# Altium schematic sheet Nixie_Sch.SchDoc
size 381 x 241 mm
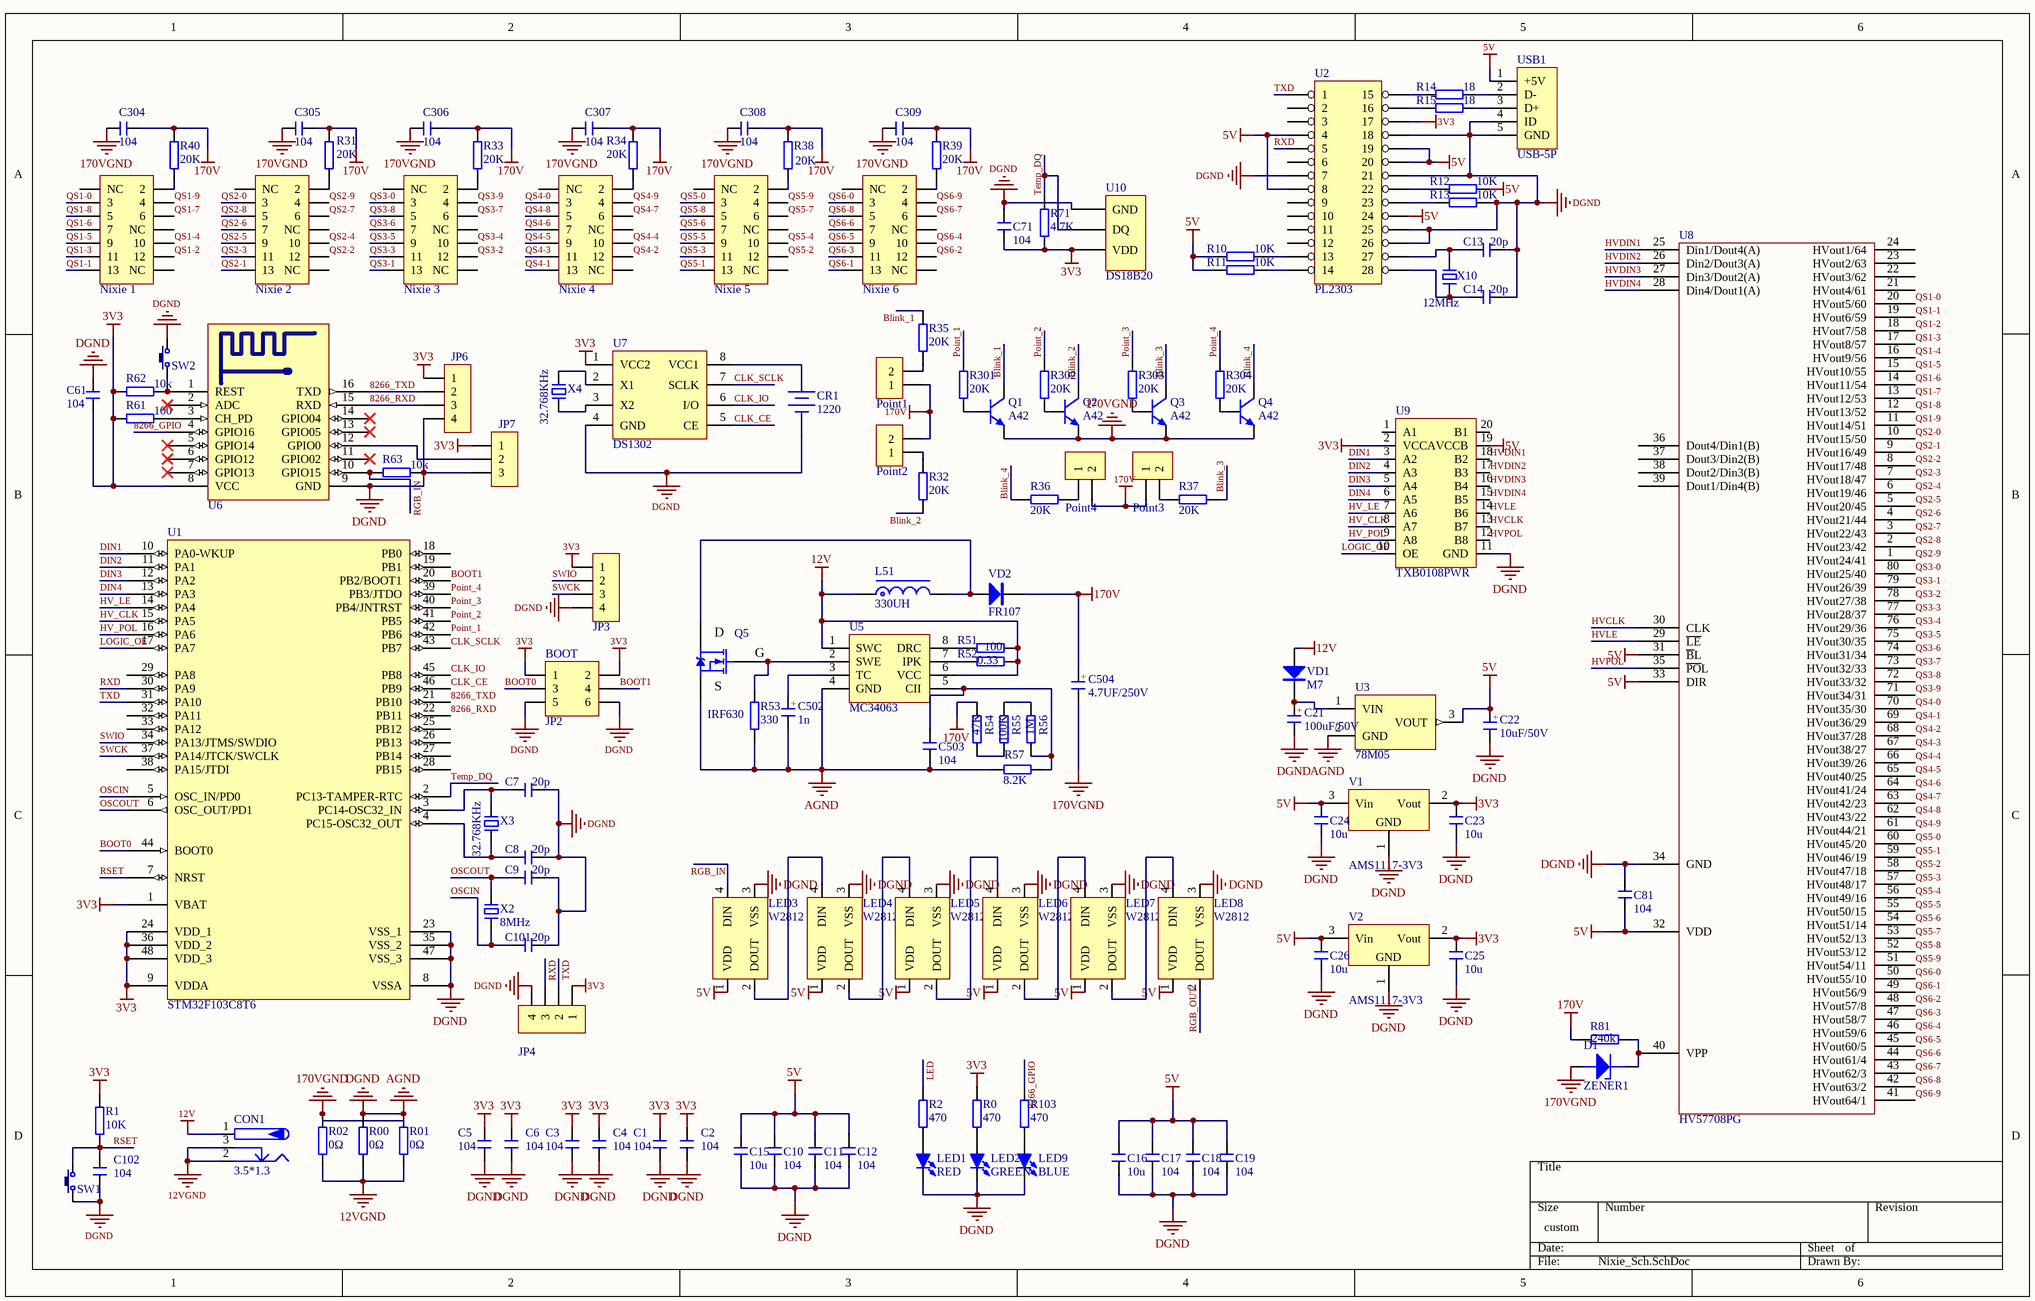
[diagram p0: Nixie_Sch.SchDoc]

## Parts
C1  104  [C 0805]
C2  104  [C 0805]
C3  104  [C 0805]
C4  104  [C 0805]
C5  104  [C 0805]
C6  104  [C 0805]
C7  20p  [C 0805]
C8  20p  [C 0805]
C9  20p  [C 0805]
C10  104  [C 0805]
C11  104  [C 0805]
C12  104  [C 0805]
C13  20p  [C 0805]
C14  20p  [C 0805]
C15  10u  [C 0805]
C16  10u  [C 0805]
C17  104  [C 0805]
C18  104  [C 0805]
C19  104  [C 0805]
C21  100uF/50V  [CM D(6.3*5.4)]
C22  10uF/50V  [CM B(4*5.4)]
C23  10u  [C 0805]
C24  10u  [C 0805]
C25  10u  [C 0805]
C26  10u  [C 0805]
C61  104  [C 0805]
C71  104  [C 0805]
C81  104  [C 0805]
C101  20p  [C 0805]
C102  104  [C 0805]
C304  104  [C 1206]
C305  104  [C 1206]
C306  104  [C 1206]
C307  104  [C 1206]
C308  104  [C 1206]
C309  104  [C 1206]
C502  1n  [CS 5.0*10*13 - C]
C503  104  [C 0805]
C504  4.7UF/250V  [CAP 3.5*8*11.5 - BK]
CON1  3.5*1.3  [DC-005]
CR1  1220  [CR1220_A]
D1  ZENER1  [DO41-10]
JP2  BOOT  [HDR-3X2]
JP3  HDR-1X4  [HDR-1X4_H]  (value not drawn)
JP4  HDR-1X4  [HDR-1X4]  (value not drawn)
JP6  HDR-1X4  [HDR-1X4]  (value not drawn)
JP7  HDR-1X3  [HDR-1X3]  (value not drawn)
L51  330UH  [CDRH73]
LED1  RED  [LED 0805R]
LED2  GREEN  [LED 0805G]
LED3  W2812  [W2812]
LED4  W2812  [W2812]
LED5  W2812  [W2812]
LED6  W2812  [W2812]
LED7  W2812  [W2812]
LED8  W2812  [W2812]
LED9  BLUE  [LED 0805B]
Nixie_1  Nixie_Header  [NIXIE_QS30-1]  (value not drawn)
Nixie_2  Nixie_Header  [NIXIE_QS30-1]  (value not drawn)
Nixie_3  Nixie_Header  [NIXIE_QS30-1]  (value not drawn)
Nixie_4  Nixie_Header  [Nixie_QS30-1]  (value not drawn)
Nixie_5  Nixie_Header  [Nixie_QS30-1]  (value not drawn)
Nixie_6  Nixie_Header  [Nixie_QS30-1]  (value not drawn)
Point1  Point  [HDR-1X2_M]  (value not drawn)
Point2  Point  [HDR-1X2_M]  (value not drawn)
Point3  Point  [HDR-1X2_M]  (value not drawn)
Point4  Point  [HDR-1X2_M]  (value not drawn)
Q1  A42  [TO92A]
Q2  A42  [TO92A]
Q3  A42  [TO92A]
Q4  A42  [TO92A]
Q5  IRF630  [TO220B]
R0  470  [R 0805]
R00  0Ω  [R 0805]
R1  10K  [R 0805]
R01  0Ω  [R 0805]
R2  470  [R 0805]
R02  0Ω  [R 0805]
R10  10K  [R 0805]
R11  10K  [R 0805]
R12  10K  [R 0805]
R13  10K  [R 0805]
R14  18  [R 0805]
R15  18  [R 0805]
R31  20K  [R 1206]
R32  20K  [R 1206]
R33  20K  [R 1206]
R34  20K  [R 1206]
R35  20K  [R 1206]
R36  20K  [R 1206]
R37  20K  [R 1206]
R38  20K  [R 1206]
R39  20K  [R 1206]
R40  20K  [R 1206]
R51  100  [R 0805]
R52  0.33  [R 0805]
R53  330  [R 0805]
R54  47K  [R 1206]
R55  100K  [R 1206]
R56  1M  [R 1206]
R57  8.2K  [R 0805]
R61  100  [R 0805]
R62  10k  [R 0805]
R63  10k  [R 0805]
R71  4.7K  [R 0805]
R81  240k  [R 0805]
R103  470  [R 0805]
R301  20K  [R 0805]
R302  20K  [R 0805]
R303  20K  [R 0805]
R304  20K  [R 0805]
SW1  3x6x5  [TSW SMD-3*6*2.5]  (value not drawn)
SW2  3x6x5  [TSW SMD-3*6*2.5]  (value not drawn)
U1  STM32F103C8T6  [LQFP48]
U2  PL2303  [SSOP28_N]
U3  78M05  [TO220B]
U5  MC34063  [SOP8_N]
U6  ESP-12  [ESP_12]  (value not drawn)
U7  DS1302  [SOP8_N]
U8  HV57708PG  [HV57708PG]
U9  TXB0108PWR  [TSSOP20_N]
U10  DS18B20  [TO92A]
USB1  USB-5P  [USB-MICRO_A]
V1  AMS1117-3V3  [SOT-223]
V2  AMS1117-3V3  [SOT-223]
VD1  M7  [SMA]
VD2  FR107  [SMA]
X2  8MHz  [XTAL-49S DIP]
X3  32.768KHz  [XTAL-3X8H]
X4  32.768KHz  [XTAL-3X8H]
X10  12MHz  [XTAL-49S DIP]

## Nets
3V3: C1.2 C2.2 C3.2 C4.2 C5.2 C6.2 C23.2 C25.2 C61.1 C71.2 JP2.1 JP2.2 JP3.1 JP4.1 JP6.1 JP7.1 R0.2 R1.2 R61.1 R62.1 R71.1 U1.1(VBAT) U1.9(VDDA) U1.24(VDD_1) U1.36(VDD_2) U1.48(VDD_3) U2.17 U6.8(VCC) U7.1(VCC2) U9.2(VCCA) U10.3(VDD) V1.2(Vout) V2.2(Vout)
5V: C10.1 C11.1 C12.1 C15.1 C16.1 C17.1 C18.1 C19.1 C22.A(+) C24.2 C26.2 C81.1 LED3.1(VDD) LED4.1(VDD) LED5.1(VDD) LED6.1(VDD) LED7.1(VDD) LED8.1(VDD) R10.1 R11.1 R12.2 U2.4 U2.8 U2.19 U2.20 U2.24 U3.3(VOUT) U8.31(~{B}L) U8.32(VDD) U8.33(DIR) U9.19(VCCB) USB1.1(+5V) V1.3(Vin) V2.3(Vin)
12V: CON1.1 L51.1 R51.2 R52.2 U5.1(SWC) U5.6(VCC) VD1.A
12VGND: CON1.2 CON1.3 R00.1 R01.1 R02.1
170V: C304.2 C305.2 C306.2 C307.2 C308.2 C309.2 C504.A Point1.1 Point2.2 Point3.1 Point4.2 R31.2 R33.2 R34.2 R38.1 R39.1 R40.1 R54.2 R81.1 VD2.K
170VGND: C1.1 C2.1 C3.1 C4.1 C5.1 C6.1 C7.2 C8.2 C9.2 C10.2 C11.2 C12.2 C13.2 C14.2 C15.2 C16.2 C17.2 C18.2 C19.2 C21.K(-) C22.K(-) C23.1 C24.1 C25.1 C26.1 C61.2 C71.1 C81.2 C101.2 C102.1 C304.1 C305.1 C306.1 C307.1 C308.1 C309.1 C502.K(-) C503.1 C504.K(-) CR1.DC- D1.A JP2.5 JP2.6 JP3.4 JP4.4 JP6.4 JP7.3 LED1.K LED2.K LED3.3(VSS) LED4.3(VSS) LED5.3(VSS) LED6.3(VSS) LED7.3(VSS) LED8.3(VSS) LED9.K Q1.1(E) Q2.1(E) Q3.1(E) Q4.1(E) Q5.3(S) R00.2 R01.2 R02.2 R13.2 R53.1 R57.1 R63.2 SW1.1 SW2.2 U1.8(VSSA) U1.23(VSS_1) U1.35(VSS_2) U1.47(VSS_3) U2.7 U2.18 U2.21 U2.25 U2.26 U3.2(GND) U5.4(GND) U6.9(GND) U7.4(GND) U8.34(GND) U9.11(GND) U10.1(GND) USB1.4(ID) USB1.5(GND) V1.1(GND) V2.1(GND)  [also labelled AGND, DGND]
8266_GPIO: R103.2 U6.4(GPIO16)
8266_RXD: JP6.3 U1.22(PB11) U6.15(RXD)
8266_TXD: JP6.2 U1.21(PB10) U6.16(TXD)
Blink_1: Q1.3(C) R35.2
Blink_2: Q2.3(C) R32.2
Blink_3: Q3.3(C) R37.2
Blink_4: Q4.3(C) R36.1
BOOT0: JP2.3 U1.44(BOOT0)
BOOT1: JP2.4 U1.20(PB2/BOOT1)
CLK_CE: U1.46(PB9) U7.5(CE)
CLK_IO: U1.45(PB8) U7.6(I/O)
CLK_SCLK: U1.43(PB7) U7.7(SCLK)
DIN1: U1.10(PA0-WKUP) U9.3(A2)
DIN2: U1.11(PA1) U9.4(A3)
DIN3: U1.12(PA2) U9.5(A4)
DIN4: U1.13(PA3) U9.6(A5)
HV_CLK: U1.15(PA5) U9.8(A7)
HV_LE: U1.14(PA4) U9.7(A6)
HV_POL: U1.16(PA6) U9.9(A8)
HVCLK: U8.30(CLK) U9.13(B7)
HVDIN1: U8.25(Din1/Dout4(A)) U9.18(B2)
HVDIN2: U8.26(Din2/Dout3(A)) U9.17(B3)
HVDIN3: U8.27(Din3/Dout2(A)) U9.16(B4)
HVDIN4: U8.28(Din4/Dout1(A)) U9.15(B5)
HVLE: U8.29(~{LE}) U9.14(B6)
HVPOL: U8.35(~{PO}L) U9.12(B8)
LED: R2.2
LOGIC_OE: U1.17(PA7) U9.10(OE)
OSCIN: C101.1 U1.5(OSC_IN/PD0) X2.1
OSCOUT: C9.1 U1.6(OSC_OUT/PD1) X2.2
Point_1: R301.2 U1.42(PB6)
Point_2: R302.2 U1.41(PB5)
Point_3: R303.2 U1.40(PB4/JNTRST)
Point_4: R304.2 U1.39(PB3/JTDO)
QS1-0: Nixie_1.3 U8.20(HVout5/60)
QS1-1: Nixie_1.13 U8.19(HVout6/59)
QS1-2: Nixie_1.12 U8.18(HVout7/58)
QS1-3: Nixie_1.11 U8.17(HVout8/57)
QS1-4: Nixie_1.10 U8.16(HVout9/56)
QS1-5: Nixie_1.9 U8.15(HVout10/55)
QS1-6: Nixie_1.7 U8.14(HVout11/54)
QS1-7: Nixie_1.6 U8.13(HVout12/53)
QS1-8: Nixie_1.5 U8.12(HVout13/52)
QS1-9: Nixie_1.4 U8.11(HVout14/51)
QS2-0: Nixie_2.3 U8.10(HVout15/50)
QS2-1: Nixie_2.13 U8.9(HVout16/49)
QS2-2: Nixie_2.12 U8.8(HVout17/48)
QS2-3: Nixie_2.11 U8.7(HVout18/47)
QS2-4: Nixie_2.10 U8.6(HVout19/46)
QS2-5: Nixie_2.9 U8.5(HVout20/45)
QS2-6: Nixie_2.7 U8.4(HVout21/44)
QS2-7: Nixie_2.6 U8.3(HVout22/43)
QS2-8: Nixie_2.5 U8.2(HVout23/42)
QS2-9: Nixie_2.4 U8.1(HVout24/41)
QS3-0: Nixie_3.3 U8.80(HVout25/40)
QS3-1: Nixie_3.13 U8.79(HVout26/39)
QS3-2: Nixie_3.12 U8.78(HVout27/38)
QS3-3: Nixie_3.11 U8.77(HVout28/37)
QS3-4: Nixie_3.10 U8.76(HVout29/36)
QS3-5: Nixie_3.9 U8.75(HVout30/35)
QS3-6: Nixie_3.7 U8.74(HVout31/34)
QS3-7: Nixie_3.6 U8.73(HVout32/33)
QS3-8: Nixie_3.5 U8.72(HVout33/32)
QS3-9: Nixie_3.4 U8.71(HVout34/31)
QS4-0: Nixie_4.3 U8.70(HVout35/30)
QS4-1: Nixie_4.13 U8.69(HVout36/29)
QS4-2: Nixie_4.12 U8.68(HVout37/28)
QS4-3: Nixie_4.11 U8.67(HVout38/27)
QS4-4: Nixie_4.10 U8.66(HVout39/26)
QS4-5: Nixie_4.9 U8.65(HVout40/25)
QS4-6: Nixie_4.7 U8.64(HVout41/24)
QS4-7: Nixie_4.6 U8.63(HVout42/23)
QS4-8: Nixie_4.5 U8.62(HVout43/22)
QS4-9: Nixie_4.4 U8.61(HVout44/21)
QS5-0: Nixie_5.3 U8.60(HVout45/20)
QS5-1: Nixie_5.13 U8.59(HVout46/19)
QS5-2: Nixie_5.12 U8.58(HVout47/18)
QS5-3: Nixie_5.11 U8.57(HVout48/17)
QS5-4: Nixie_5.10 U8.56(HVout49/16)
QS5-5: Nixie_5.9 U8.55(HVout50/15)
QS5-6: Nixie_5.7 U8.54(HVout51/14)
QS5-7: Nixie_5.6 U8.53(HVout52/13)
QS5-8: Nixie_5.5 U8.52(HVout53/12)
QS5-9: Nixie_5.4 U8.51(HVout54/11)
QS6-0: Nixie_6.3 U8.50(HVout55/10)
QS6-1: Nixie_6.13 U8.49(HVout56/9)
QS6-2: Nixie_6.12 U8.48(HVout57/8)
QS6-3: Nixie_6.11 U8.47(HVout58/7)
QS6-4: Nixie_6.10 U8.46(HVout59/6)
QS6-5: Nixie_6.9 U8.45(HVout60/5)
QS6-6: Nixie_6.7 U8.44(HVout61/4)
QS6-7: Nixie_6.6 U8.43(HVout62/3)
QS6-8: Nixie_6.5 U8.42(HVout63/2)
QS6-9: Nixie_6.4 U8.41(HVout64/1)
RGB_IN: LED3.4(DIN) R63.1 U6.10(GPIO15)
RGB_OUT: LED8.2(DOUT)
RSET: C102.2 R1.1 SW1.2 U1.7(NRST)
RXD: JP4.3 U1.30(PA9) U2.5
SWCK: JP3.3 U1.37(PA14/JTCK/SWCLK)
SWIO: JP3.2 U1.34(PA13/JTMS/SWDIO)
Temp_DQ: R71.2 U1.2(PC13-TAMPER-RTC) U10.2(DQ)
TXD: JP4.2 U1.31(PA10) U2.1
NetC7_1: C7.1 U1.3(PC14-OSC32_IN) X3.2
NetC8_1: C8.1 U1.4(PC15-OSC32_OUT) X3.1
NetC13_1: C13.1 U2.27 X10.2
NetC14_1: C14.1 U2.28 X10.1
NetC21_A: C21.A(+) U3.1(VIN) VD1.K
NetC502_A: C502.A U5.3(TC)
NetC503_2: C503.2 R56.1 R57.2 U5.5(CII)
NetCR1_DC+: CR1.DC+ U7.8(VCC1)
NetD1_K: D1.K R81.2 U8.40(VPP)
NetJP7_2: JP7.2 U6.12(GPIO0)
NetL51_2: L51.2 Q5.2(D) VD2.A
NetLED1_A: LED1.A R2.1
NetLED2_A: LED2.A R0.1
NetLED3_2: LED3.2(DOUT) LED4.4(DIN)
NetLED4_2: LED4.2(DOUT) LED5.4(DIN)
NetLED5_2: LED5.2(DOUT) LED6.4(DIN)
NetLED6_2: LED6.2(DOUT) LED7.4(DIN)
NetLED7_2: LED7.2(DOUT) LED8.4(DIN)
NetLED9_A: LED9.A R103.1
NetNixie_1_2: Nixie_1.2 R40.2
NetNixie_2_2: Nixie_2.2 R31.1
NetNixie_3_2: Nixie_3.2 R33.1
NetNixie_4_2: Nixie_4.2 R34.1
NetNixie_5_2: Nixie_5.2 R38.2
NetNixie_6_2: Nixie_6.2 R39.2
NetPoint1_2: Point1.2 R35.1
NetPoint2_1: Point2.1 R32.1
NetPoint3_2: Point3.2 R37.1
NetPoint4_1: Point4.1 R36.2
NetQ1_2: Q1.2(B) R301.1
NetQ2_2: Q2.2(B) R302.1
NetQ3_2: Q3.2(B) R303.1
NetQ4_2: Q4.2(B) R304.1
NetQ5_1: Q5.1(G) R53.2 U5.2(SWE)
NetR10_2: R10.2 U2.13
NetR11_2: R11.2 U2.14
NetR12_1: R12.1 U2.22
NetR13_1: R13.1 U2.23
NetR14_1: R14.1 U2.15
NetR14_2: R14.2 USB1.2(D-)
NetR15_1: R15.1 U2.16
NetR15_2: R15.2 USB1.3(D+)
NetR51_1: R51.1 U5.8(DRC)
NetR52_1: R52.1 U5.7(IPK)
NetR54_1: R54.1 R55.1
NetR55_2: R55.2 R56.2
NetR61_2: R61.2 U6.3(CH_PD)
NetR62_2: R62.2 SW2.1 U6.1(REST)
NetU7_2: U7.2(X1) X4.2
NetU7_3: U7.3(X2) X4.1

Not connected (* = marked no-connect by the designer): Nixie_1 1(NC) 8(NC) 14(NC); Nixie_2 1(NC) 8(NC) 14(NC); Nixie_3 1(NC) 8(NC) 14(NC); Nixie_4 1(NC) 8(NC) 14(NC); Nixie_5 1(NC) 8(NC) 14(NC); Nixie_6 1(NC) 8(NC) 14(NC); U1 18(PB0) 19(PB1) 25(PB12) 26(PB13) 27(PB14) 28(PB15) 29(PA8) 32(PA11) 33(PA12) 38(PA15/JTDI); U2 2 3 6 9 10 11 12; U6 2(ADC)* 5(GPIO14)* 6(GPIO12)* 7(GPIO13)* 11(GPIO02)* 13(GPIO05)* 14(GPIO04)*; U8 21(HVout4/61) 22(HVout3/62) 23(HVout2/63) 24(HVout1/64) 36(Dout4/Din1(B)) 37(Dout3/Din2(B)) 38(Dout2/Din3(B)) 39(Dout1/Din4(B)); U9 1(A1) 20(B1)

## Notes on the sheet
- (in symbol C-CAP) +
- (in symbol C-CS) +

## Library data of the parts
C1-C19 C23-C26 C61 C71 C81 C101 C102 C304-C309 C503 = C: 无极性贴片电容; 版权归属: 源创客; BOM名称: 无极性贴片电容; 学习资源: www.ooocke.com
C21 C22 = C-CM: 贴片电解电容; 版权归属: 源创客; BOM名称: 贴片电解电容; 学习资源: www.ooocke.com
C502 = C-CS: 直插固态电容; 版权归属: 源创客; BOM名称: 直插固态电容; 学习资源: www.ooocke.com
C504 = C-CAP: 直插电解电容; 版权归属: 源创客; BOM名称: 直插电解电容; 学习资源: www.ooocke.com
CON1 = P-DC: 低压电源接口; BOM名称: DC电源接口; 版权归属: 源创客; 学习资源: www.ooocke.com
CR1 = CR-3V: 微型电池; 版权归属: 源创客; BOM名称: 微型电池; 学习资源: www.ooocke.com
D1 = ZENER1: Zener Diode
JP2 = Header 3X2: 3*2P接插件; 版权归属: 源创客; BOM名称: 3*2P接插件; 学习资源: www.ooocke.com
JP3 JP4 JP6 = Header 4: 4P接插件; 版权归属: 源创客; BOM名称: 4P接插件; 学习资源: www.ooocke.com
JP7 = Header 3: 3P接插件; 版权归属: 源创客; BOM名称: 3P接插件; 学习资源: www.ooocke.com
L51 = L-CDRH: 功率屏蔽电感; 版权归属: 源创客; BOM名称: 功率屏蔽电感; 学习资源: www.ooocke.com
LED1 LED2 LED9 = LED-SMD: 贴片LED; 版权归属: 源创客; BOM名称: 贴片LED; 学习资源: www.ooocke.com
Nixie_1-Nixie_6 = Nixie: QS30-1
Q1-Q4 = 9013-DIP: 低频放大-NPN型; 版权归属: 源创客; 属性: 50V 0.5A 0.625W; BOM名称: 低频放大-NPN型; 学习资源: www.ooocke.com
Q5 = IRF3710: N沟场效应管; 版权归属: 源创客; BOM名称: N沟场效应管; 学习资源: www.ooocke.com
R0 R00 R1 R01 R2 R02 R10-R15 R31-R40 R51-R57 R61-R63 R71 R81 R103 R301-R304 = R: 贴片电阻; 版权归属: 源创客; BOM名称: 贴片电阻; 学习资源: www.ooocke.com
SW1 SW2 = TSW 3x6: 3x6轻触开关; 版权归属: 源创客; BOM名称: 3x6轻触开关; 学习资源: www.ooocke.com
U1 = STM32F103C8T6: 32位STM单片机; 版权归属: 源创客; BOM名称: 32位STM单片机; 学习资源: www.ooocke.com
U2 = PL2303: PL2303HXA
U3 = 78M05: CI-78M05
U7 = DS1302: 实时时钟芯片; 版权归属: 源创客; BOM名称: 实时时钟芯片; 学习资源: www.ooocke.com
U8 = HV57708PG: 串转并
U9 = TXB0108PWR: 逻辑电平转换芯片
U10 = DS18B20: 数字温度计; 版权归属: 源创客; BOM名称: 数字温度计; 学习资源: www.ooocke.com
USB1 = USB-5P: 微型USB母座; 版权归属: 源创客; BOM名称: 微型USB母座; 学习资源: www.ooocke.com
V1 V2 = AMS1117: 三端稳压芯片; BOM名称: 稳压芯片; 版权归属: 源创客; 学习资源: www.ooocke.com
VD1 = M7: 肖特基二极管; BOM名称: 整流二极管; 版权归属: 源创客; 学习资源: www.ooocke.com
VD2 = FR107: 快恢复整流二极管; BOM名称: 快恢复二极管; 版权归属: 源创客; 属性: 700V/1A; 学习资源: www.ooocke.com
X2-X4 X10 = XTAL-2: 2脚晶振; 版权归属: 源创客; BOM名称: 2脚晶振; 学习资源: www.ooocke.com